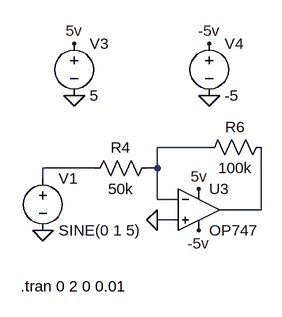
[diagram p0: schematic postamp.asc]
postamp.asc, the LTspice schematic file:
Version 4
SHEET 1 1124 680
WIRE 624 -512 544 -512
WIRE 448 -480 368 -480
WIRE 544 -480 544 -512
WIRE 544 -480 528 -480
WIRE 368 -464 368 -480
WIRE 544 -432 544 -480
WIRE 576 -432 544 -432
WIRE 704 -416 704 -512
WIRE 704 -416 640 -416
WIRE 576 -400 544 -400
FLAG 368 -384 0
FLAG 624 -592 0
FLAG 416 -592 0
FLAG 416 -672 5v
FLAG 608 -448 5v
FLAG 624 -672 -5v
FLAG 608 -384 -5v
FLAG 544 -400 0
SYMBOL voltage 368 -480 R0
WINDOW 123 0 0 Left 0
WINDOW 39 0 0 Left 0
SYMATTR InstName V1
SYMATTR Value SINE(0 1 5)
SYMBOL res 544 -496 R90
WINDOW 0 0 56 VBottom 2
WINDOW 3 32 56 VTop 2
SYMATTR InstName R4
SYMATTR Value 50k
SYMBOL OpAmps\\OP747 608 -480 R0
SYMATTR InstName U3
SYMBOL res 720 -528 R90
WINDOW 0 0 56 VBottom 2
WINDOW 3 32 56 VTop 2
SYMATTR InstName R6
SYMATTR Value 100k
SYMBOL voltage 416 -688 R0
WINDOW 123 0 0 Left 0
WINDOW 39 0 0 Left 0
SYMATTR InstName V3
SYMATTR Value 5
SYMBOL voltage 624 -688 R0
WINDOW 123 0 0 Left 0
WINDOW 39 0 0 Left 0
SYMATTR InstName V4
SYMATTR Value -5
TEXT 334 -298 Left 2 !.tran 0 2 0 0.01

The netlist it stands for:
* postamp.asc
V1 N002 0 SINE(0 1 5)
R4 N001 N002 50k
XU3 0 N001 5v -5v N003 OP747  ; pins In+ In- V+ V- OUT
R6 N003 N001 100k
V3 5v 0 5
V4 -5v 0 -5
.tran 0 2 0 0.01
.backanno
.end